# Altium schematic sheet fpga_eagle_1.SchDoc
size 468 x 400 mm
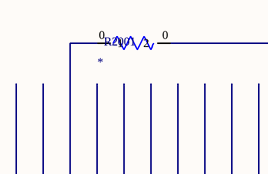
[diagram p0: fpga_eagle_1.SchDoc, top left]
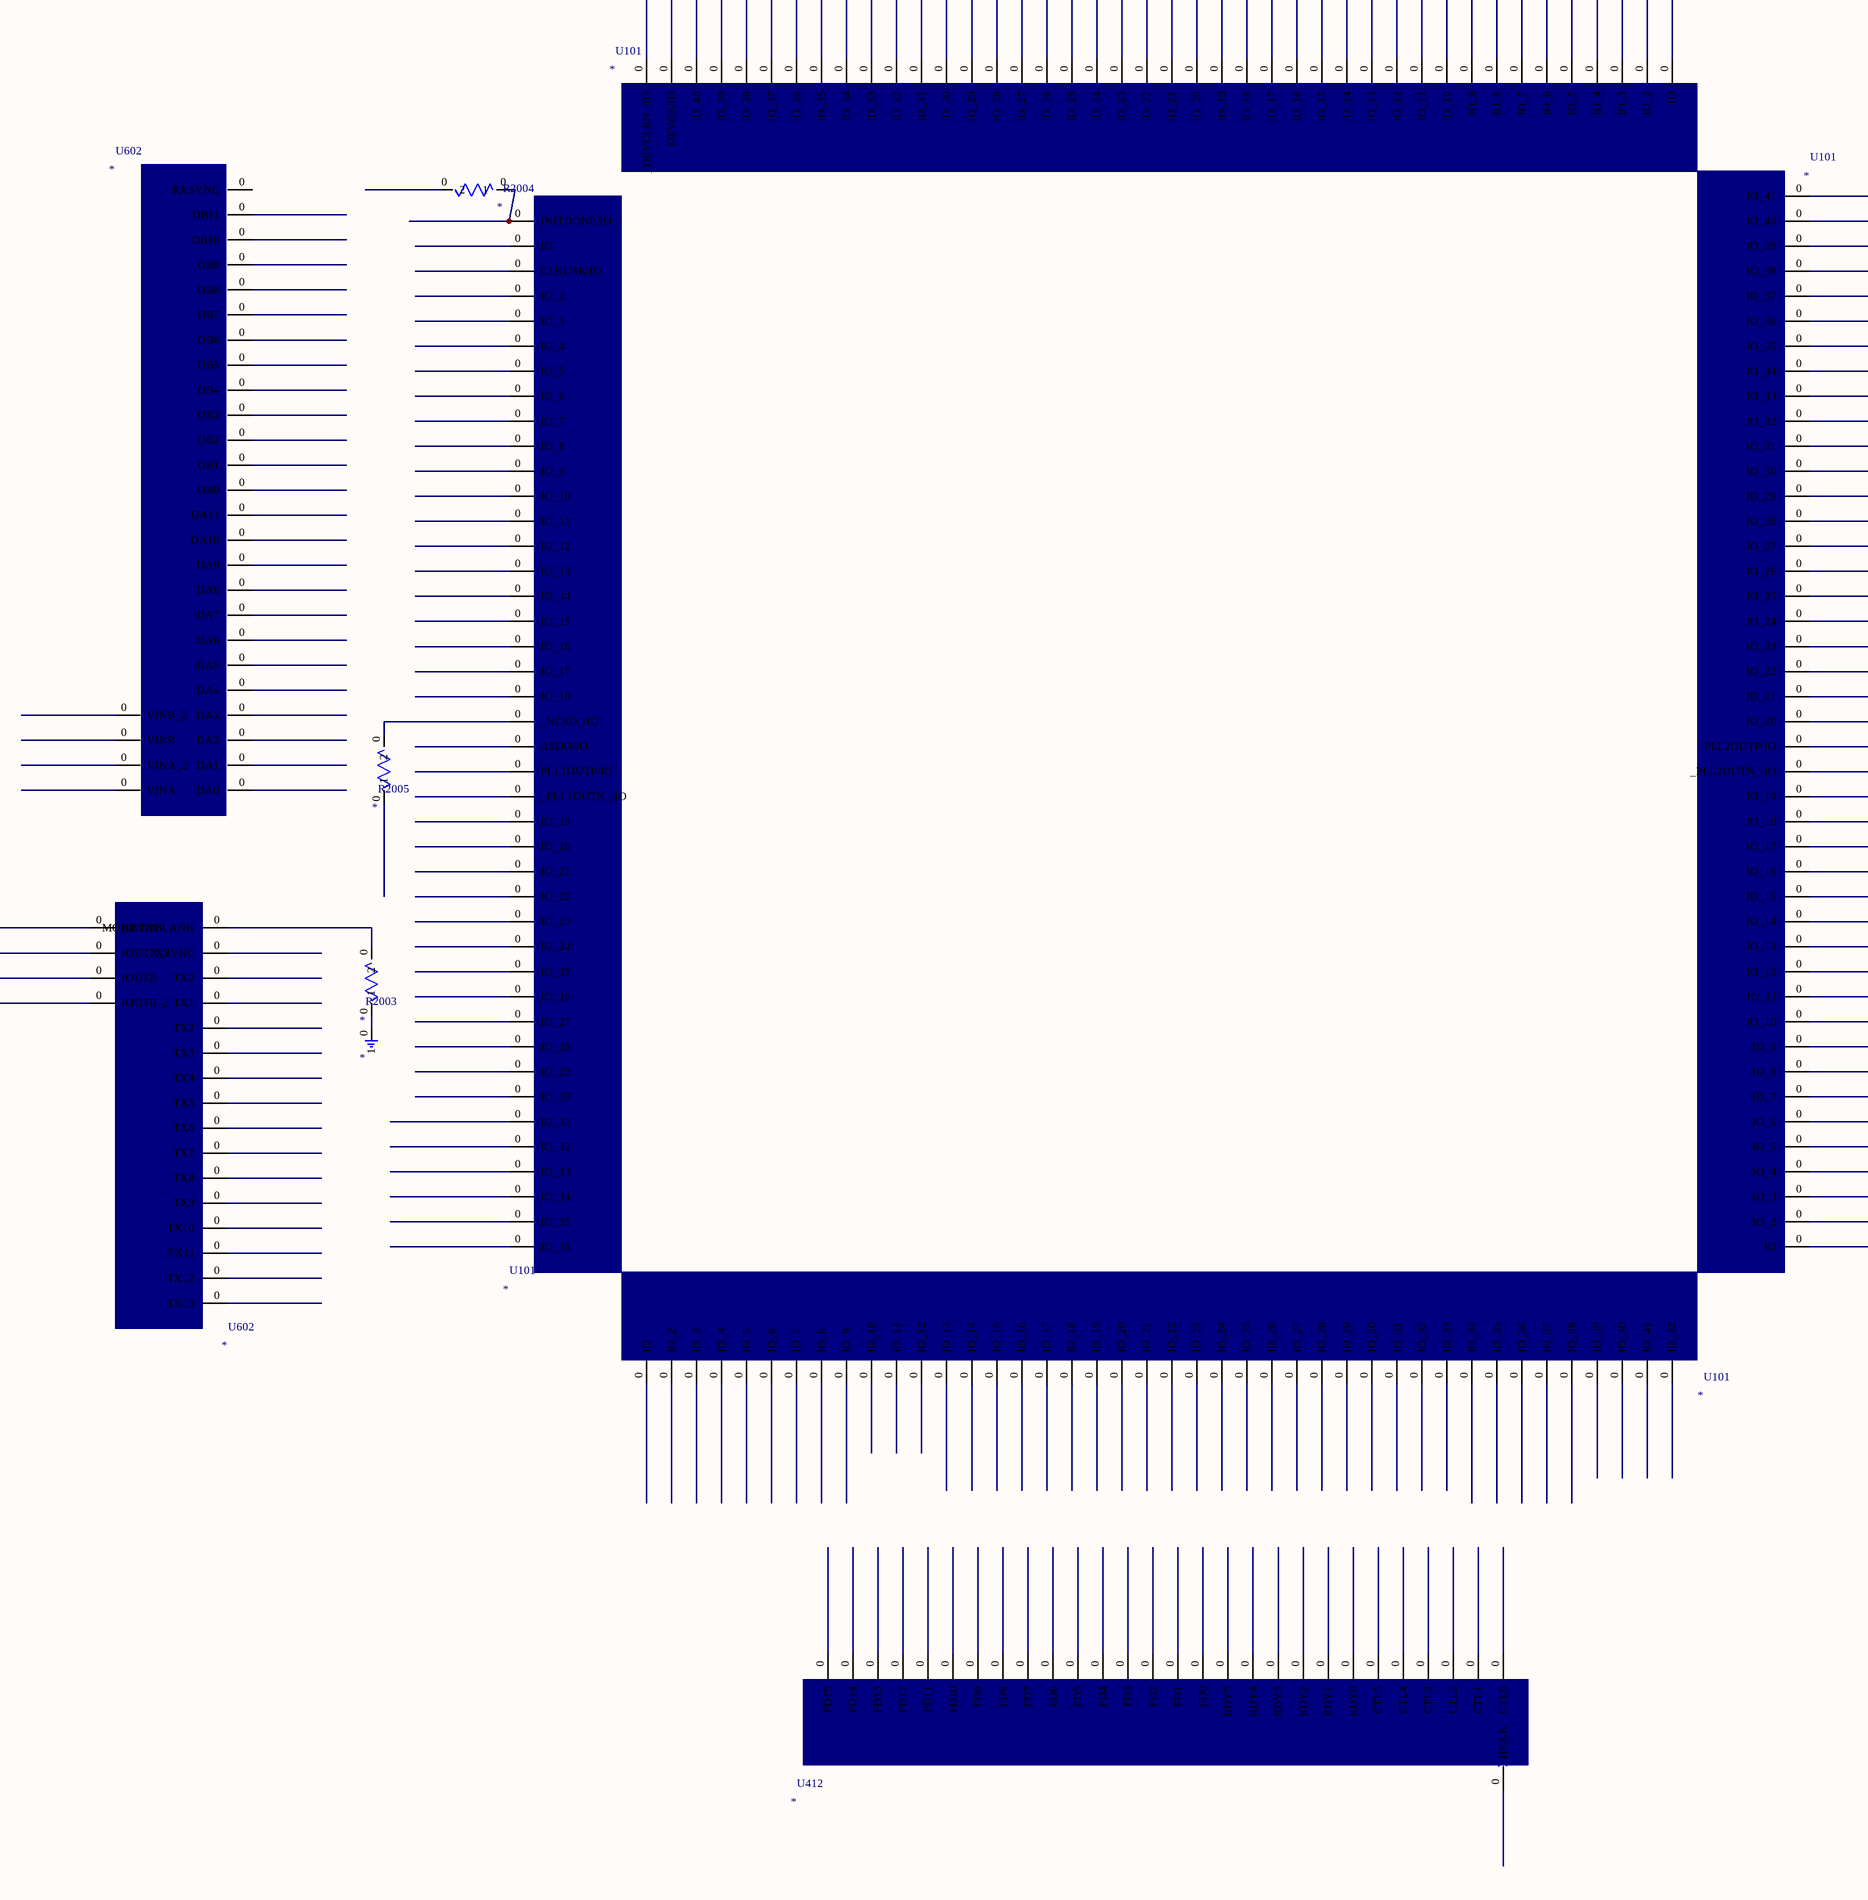
[diagram p1: fpga_eagle_1.SchDoc, bottom left]
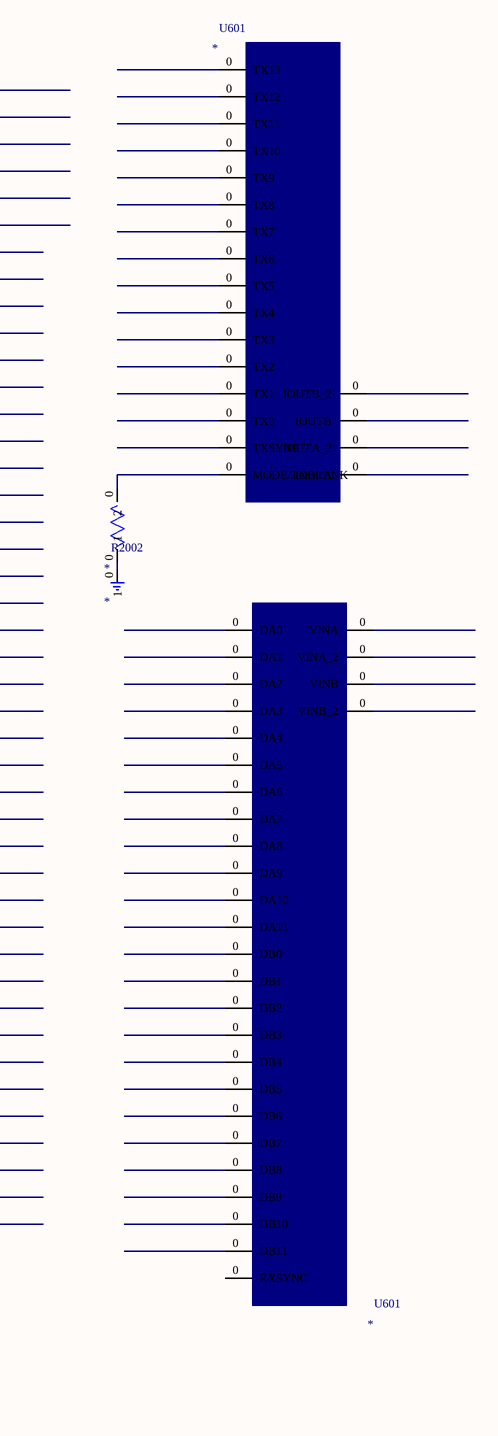
[diagram p2: fpga_eagle_1.SchDoc, bottom right]

## Parts
GND-1  *
GND-1-5  *
R2001  *
R2002  *
R2003  *
R2004  *
R2005  *
U101  *
U101-1  *
U101-2  *
U101-3  *
U412  *
U601  *
U601-0  *
U602  *
U602-4  *

## Nets
NetGND-1-5_0: GND-1-5.0(1) R2002.0(1)
NetGND-1_0: GND-1.0(1) R2003.0(1)
NetR2001_0: R2001.0(1) U101-1.0(DEVOE/IO)
NetR2002_0: R2002.0(2) U601-0.0(IOUTA)
NetR2003_0: R2003.0(2) U602-4.0(IOUTA)
NetR2004_0: R2004.0(1) U101.0(ASDO/IO)
NetR2005_0: R2005.0(1) U101.0(_NCSO_/IO)

Not connected (* = marked no-connect by the designer): U101-2 0(IO); U101-3 0(IO); U412 0(CTL0); U601 0(DA0); U602 0(DA0)

## Notes on the sheet
- (in symbol AD986X-TX_MIRRORED) U601; U602
- (in symbol EP1C12-PQ240-IO2) U101
- (in symbol EP1C12-PQ240-IO3) U101
- (in symbol EP1C12-PQ240-IO4) U101

## Library data of the parts
GND-1 GND-1-5 = GND-1
R2001 = RESISTOR-1
R2002-R2005 = RESISTOR-1_MIRRORED
U101 = EP1C12-PQ240-IO1
U101-1 = EP1C12-PQ240-IO2
U101-2 = EP1C12-PQ240-IO3
U101-3 = EP1C12-PQ240-IO4
U412 = CY7C68013-TQ100-BUS_MIRRORED
U601 U602 = AD986X-RX_MIRRORED
U601-0 U602-4 = AD986X-TX_MIRRORED